# Altium schematic sheet Power Supply.SchDoc
size A; SheetNumber: 2; SheetTotal: 15
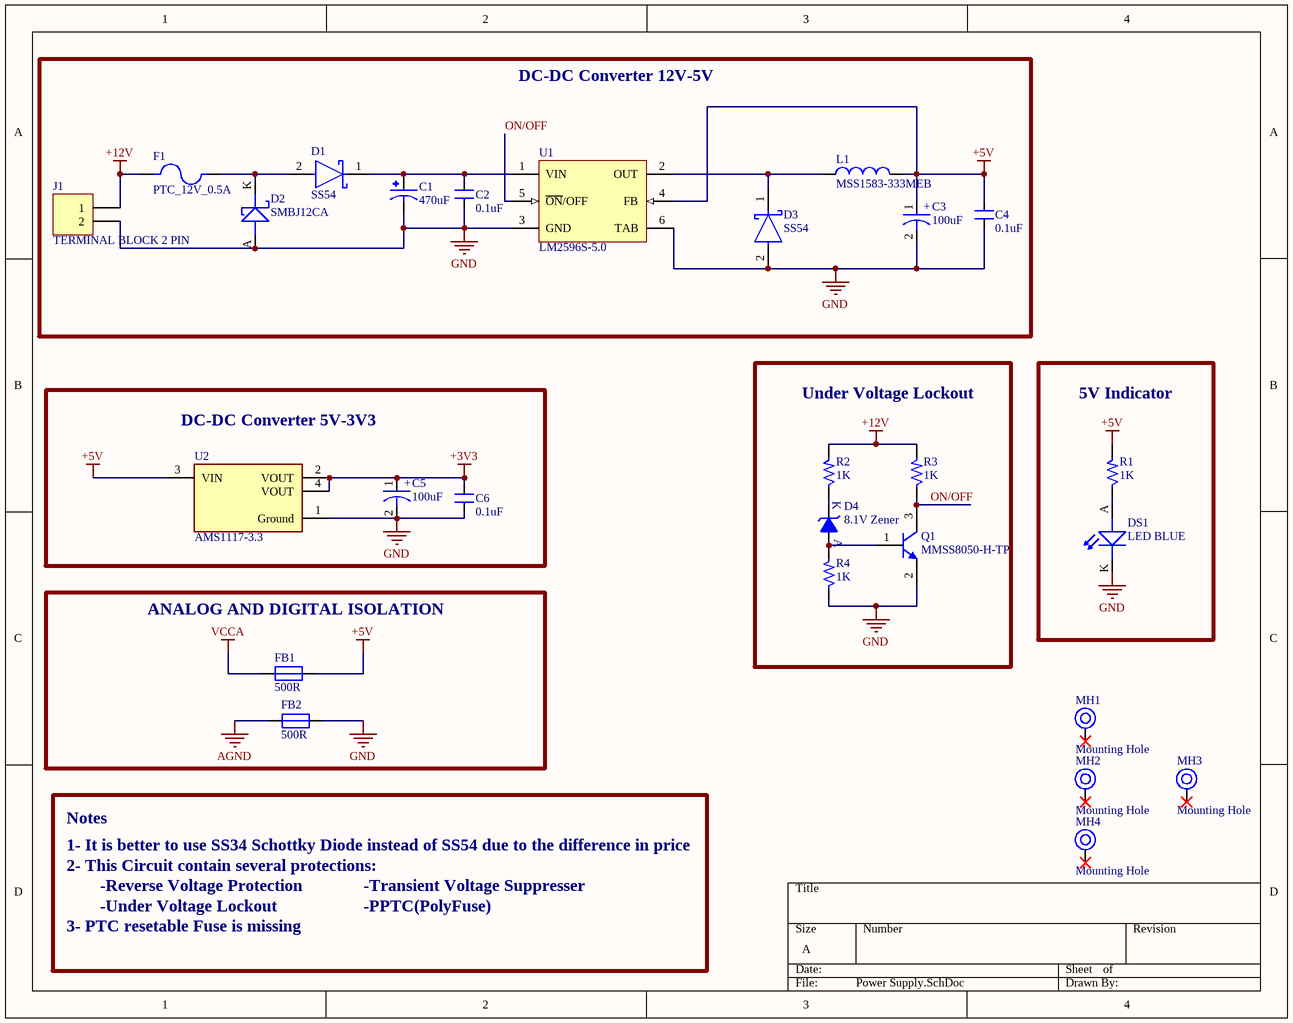
[diagram p0: Power Supply.SchDoc]

## Parts
C1  470uF  [CAPPRD500W50D630H1120]
C2  0.1uF  [CAP_0805]
C3  100uF  [ACAP_P305_D393_H393_RAD]
C4  0.1uF  [CAP_0805]
C5  100uF  [ACAP_P236_D305_H303_RAD]
C6  0.1uF  [CAP_0805]
D1  SS54  [FP-95400-MFG]
D2  SMBJ12CA  [DIO_SMB_DO-214AA]
D3  SS54  [FP-95400-MFG]
D4  8.1V Zener  [DIO_SOD80C]
DS1  LED BLUE  [LED_0805]
F1  PTC_12V_0.5A  [FUSER_MF-MSMF200]
FB1  500R  [IND_0805]
FB2  500R  [IND_0805]
J1  TERMINAL BLOCK 2 PIN  [CON2_P196_1729128_TH_ST]
L1  MSS1583-333MEB  [IND_456_640_236X117_SMD]
MH1  Mounting Hole  [MOUNTING]
MH2  Mounting Hole  [MOUNTING]
MH3  Mounting Hole  [MOUNTING]
MH4  Mounting Hole  [MOUNTING]
Q1  MMSS8050-H-TP  [SOT 23-3]
R1  1K  [RES_0805]
R2  1K  [RES_0805]
R3  1K  [RES_0805]
R4  1K  [RES_0805]
U1  LM2596S-5.0  [TO170P1524X483-6N]
U2  AMS1117-3.3  [FP-AMS1117-IPC_A]

## Blocks framed on the sheet
DC-DC Converter 12V-5V: C1-C4 D1-D3 F1 J1 L1 U1
DC-DC Converter 5V-3V3: C5 C6 U2
Under Voltage Lockout: D4 Q1 R2-R4
5V Indicator: DS1 R1
ANALOG AND DIGITAL ISOLATION: FB1 FB2

## Nets
+3V3: C5.1 C6.2 U2.2(VOUT) U2.4(VOUT)
+5V: C3.1 C4.2 FB1.2 L1.2 R1.2 U1.4(FB) U2.3(VIN)
+12V: F1.1 J1.1 R2.2 R3.2
AGND: FB2.1
GND: C1.N C2.1 C3.2 C4.1 C5.2 C6.1 D2.A D3.2(A) DS1.K(CATHODE) FB2.2 J1.2 Q1.2(E) R4.1 U1.3(GND) U1.6(TAB) U2.1(Ground)
VCCA: FB1.1
ON/OFF: Q1.3(C) R3.1 U1.5(~{ON}/OFF)
NetC1_P: C1.P C2.2 D1.1(C) U1.1(VIN)
NetD1_2: D1.2(A) D2.K F1.2
NetD3_1: D3.1(C) L1.1 U1.2(OUT)
NetD4_A: D4.A Q1.1(B) R4.2
NetD4_K: D4.K R2.1
NetDS1_A: DS1.A(ANODE) R1.1

Not connected (* = marked no-connect by the designer): MH1 1*; MH2 1*; MH3 1*; MH4 1*

## Notes on the sheet
- Notes
- 1- It is better to use SS34 Schottky Diode instead of SS54 due to the difference in price
- 2- This Circuit contain several protections:
- -Reverse Voltage Protection
- -Under Voltage Lockout
- -Transient Voltage Suppresser
- -PPTC(PolyFuse)
- 3- PTC resetable Fuse is missing
- (in symbol CAP-P_100uF-25V-20%-RAD) +
- (in symbol CAP-P_100uF-50V-20%-RAD) +

## Library data of the parts
C1 = CAP_100uF_25V_TH: 100F 25V Aluminum Electrolytic Capacitors Radial, Can 1000 Hrs @ 105C; MF: Panasonic; MP: EEU-FC1E101SB; Purchase-URL: https://pricing.snapeda.com/search/part/EEU-FC1E101SB/?ref=eda; Value: *; SnapEDA_Link: https://www.snapeda.com/parts/EEU-FC1E101SB/Panasonic/view-part/?ref=snap; Price: None; Package: RADIAL-2 Panasonic; Check_prices: https://www.snapeda.com/parts/EEU-FC1E101SB/Panasonic/view-part/?ref=eda; Availability: In Stock; ClassName: PWR
C2 C4 C6 = CAP_0.1uF-50V-20%-0805: 0.1µF ±20% 50V Ceramic Capacitor X7R 0805 (2012 Metric); Manufacturer: Samsung Electro-Mechanics; Manufacturer Part Number: CL21B104MBCNNNC; Alternate Part Number-1: NA; Case/Package: 0805; Supplier-1: SIRICOM; Supplier Part Number-1: 0805B104K500CT; ClassName: PWR
C3 = CAP-P_100uF-50V-20%-RAD: 100µF 50V Aluminum Polymer Capacitor Radial, Can - SMD 28mOhm 4000 Hrs @ 125°C; Manufacturer: Nichicon; Manufacturer Part Number: GYA1H101MCQ1GS; Alternate Part Number-1: VEU101M1HTR-1010; Case/Package: Radial-SMD; Supplier-1: SP ROAD; Supplier Part Number-1: GYA1H101MCQ1GS; ClassName: PWR
C5 = CAP-P_100uF-25V-20%-RAD: 100µF 25V Aluminum Electrolytic Capacitors Radial, Can - SMD 1000 Hrs @ 105°C; Manufacturer: Nichicon; Manufacturer Part Number: UWT1E101MCL1GS; Alternate Part Number-1: NA; Case/Package: Radial-SMD; Supplier-1: SP ROAD; Supplier Part Number-1: UWT1E101MCL1GS; ClassName: PWR
D1 D3 = SS54-Schottky-40V-3A-DO214AC: DIODE SCHOTTKY 40V 5A DO214AC; Element Configuration: Single; Max Reverse Leakage Current: 200uA; Polarity: Standard; Peak Non-Repetitive Surge Current: 100A; Max Reverse Current: 0.1mA; Forward Voltage: 550mV; Max Forward Surge Current (Ifsm): 75A; Radiation Hardening: No; Current Rating: 5A; Contact Plating: Tin; Output Current: 5A; Height: 2.087mm; Mount: Surface Mount; Case/Package: SMA; Packaging: Tape and Reel; Width: 2.79mm; Average Rectified Current: 5A; Max Repetitive Reverse Voltage (Vrrm): 40V; Max Operating Temperature: 150°C; Length: 4.5mm; RoHS Compliant: Yes; Voltage Rating (DC): 40V; Min Operating Temperature: -65°C; Max Reverse Voltage (DC): 40V; Number of Pins: 2; Lead Free: Lead Free; Forward Current: 5A; Max Surge Current: 100A; Package Quantity: 1; ClassName: PWR
D2 = DIO-T_12V-19.9V-30A-DO214AA: 19.9V Clamp 30.2A Ipp Tvs Diode Surface Mount DO-214AA (SMBJ); Manufacturer: Texas Instruments; Alternate Part Number-1: SMBJ12CA-H; Manufacturer Part Number: SMBJ12CA; Case/Package: DO214AA; Supplier-1: SIRICOM; Supplier Part Number-1: SMBJ12CA; ClassName: PWR
D4 = DIO-Z_8.1V-500mW-SOD-80: Zener Diode 8.2V 500mW Surface Mount SOD-80 MiniMELF; Manufacturer: Microsemi; Manufacturer Part Number: TZMA8V2-GS08; Alternate Part Number-1: NA; Case/Package: SOD-80; Supplier-1: SIRICOM; Supplier Part Number-1: BZV55-C8V2; ClassName: PWR
DS1 = LED_BLUE-3V3-20mA-0805: Blue 470nm LED Indication - Discrete 3.3V 0805 (2012 Metric); Manufacturer: Vishay Lite-On; Manufacturer Part Number: LTST-C171TBKT; Alternate Part Number-1: NA; Case/Package: 0805; Supplier-1: SP ROAD; Supplier Part Number-1: LTST-C171TBKT; ClassName: PWR
F1 = PTC_8V_2A_SMD_1812: MF-MSMF200_Polymeric PTC Resettable Fuse 8V 2A Ih Surface Mount 1812 (4532 Metric), Concave; MF: Bourns; Value: *; SnapEDA_Link: https://www.snapeda.com/parts/MF-MSMF200/Bourns/view-part/4874733/?ref=snap; MP: MF-MSMF200; Check_prices: https://www.snapeda.com/parts/MF-MSMF200/Bourns/view-part/4874733/?ref=eda; Availability: Unavailable; Price: None; Package: None; ClassName: PWR
FB1 FB2 = FB_500R-100Mhz-500mA-0805: 500 Ohms @ 100MHz 1 Ferrite Bead 0805 (2012 Metric) 500mA 300mOhm; Manufacturer: Abracon; Manufacturer Part Number: ACML-0805-501-T; Alternate Part Number-1: NA; Case/Package: 0805; Supplier-1: SIRICOM; Supplier Part Number-1: ACMS201209A601 2A; ClassName: PWR
J1 = CON-TB_2X1-196-ST-TH: 2 Pins, 1 Row 5mm Pitch, straight Connector, male; Manufacturer: Phoenix Contact; Manufacturer Part Number: MKDSN1,5/2; Alternate Part Number-1: NA; Case/Package: TH-CON; Supplier-1: SP ROAD; Supplier Part Number-1: MKDSN1,5/2; ClassName: PWR
L1 = IND_33uH-8A-20%-SMD: Fixed Inductors MSS1583 SMT Power 0.038Ohms 33uH; Manufacturer: Coilcraft; Alternate Part Number-1: NA; Manufacturer Part Number: MSS1583-333MEB; Case/Package: SMD; Supplier-1: COILCRAFT SAMPLE; Supplier Part Number-1: MSS1583-333MEB; ClassName: PWR
MH1-MH4 = MH_3.5H_6D: Manufacturer Part Number: NA; Case/Package: TH; Manufacturer: NA; Supplier-1: NA; Supplier Part Number-1: NA; Alternate Part Number-1: NA
Q1 = TRNS-NPN_25V-1.5A-SOT23: Bipolar (BJT) Transistor NPN 25V 1.5A 100MHz 625mW Surface Mount SOT-23; Manufacturer: MCC; Alternate Part Number-1: NA; Manufacturer Part Number: MMSS8050-H-TP; Case/Package: SOT-23; Supplier-1: MOUSER; Supplier Part Number-1: MMSS8050-H-TP; ClassName: PWR
R1-R4 = RES_1K-0.125W-1%-0805: 1 kOhms ±1% 0.125W, 1/8W Chip Resistor 0805 (2012 Metric) Moisture Resistant Thick Film; Manufacturer: Walsin; Manufacturer Part Number: WR08X1001FTL; Case/Package: 0805; Supplier-1: SP ROAD; Supplier Part Number-1: RC0805JR-071KL; Alternate Part Number-1: WR08X1001FTL; ClassName: PWR
U1 = LM2596S-5.0/SMPS: SIMPLE SWITCHER® Power Converter 150 KHz 3A Step-Down Voltage Regulator, 5-pin TO-263, Pb-Free; Manufacturer: Texas Instruments; PowerWise: N; PackageTopMarking: NSUZXYTTE#*LM2596S*-5.0 P+; ComponentLink1URL: http://www.ti.com/general/docs/lit/getliterature.tsp?genericPartNumber=LM2596&fileType=pdf; PackageDescription: TO-263, Molded, .400 x .390 x .180in, 5 Lead, .067in Pitch, Surface Mount; RoHS: Y; PinCount: 5; Code_JEDEC: MO-169-AB; ComponentLink1Description: Datasheet URL; PackageReference: KTT0005B; CompType: Switcher; ClassName: PWR
U2 = AMS1117-3.3/LDO: LDO Voltage Regulators 1A, 3.3V; Manufacturer: Advanced Monolithic Systems; Dropout Voltage: 1.1V; Output Type: Fixed; Nominal Supply Current: 5mA; Max Power Dissipation: 1.2W; Max Supply Voltage: 15V; Number Of Outputs: 1; Standoff Height: 0.64mm; Max Junction Temp: +125°C; Height: 1.8mm; Package: AMS1117; Device Class L2: Power Management ICs; ComponentLink2Description: Datasheet; ComponentLink2URL: http://www.advanced-monolithic.com/pdf/ds1117.pdf; Category: IC; RoHS: TRUE; Automotive: No; Device Class L1: Integrated Circuits (ICs); Output Current: 1A; Device Class L3: Voltage Regulators - Linear; Temperature: -40°C to +125°C; Output Voltage: 3.3V; Manufacturer Part Number: AMS1117-3.3; Temperature Range Low: -40°C; Octopart: https://octopart.com/ams1117-3.3-advanced+monolithic+systems-25899300; Lead Free: Yes; Ipc Land Pattern Name: SOT229P700X180-4; Temperature Range High: +125°C; ClassName: PWR